# Altium project UmbilicalBoardV3.PrjPcb
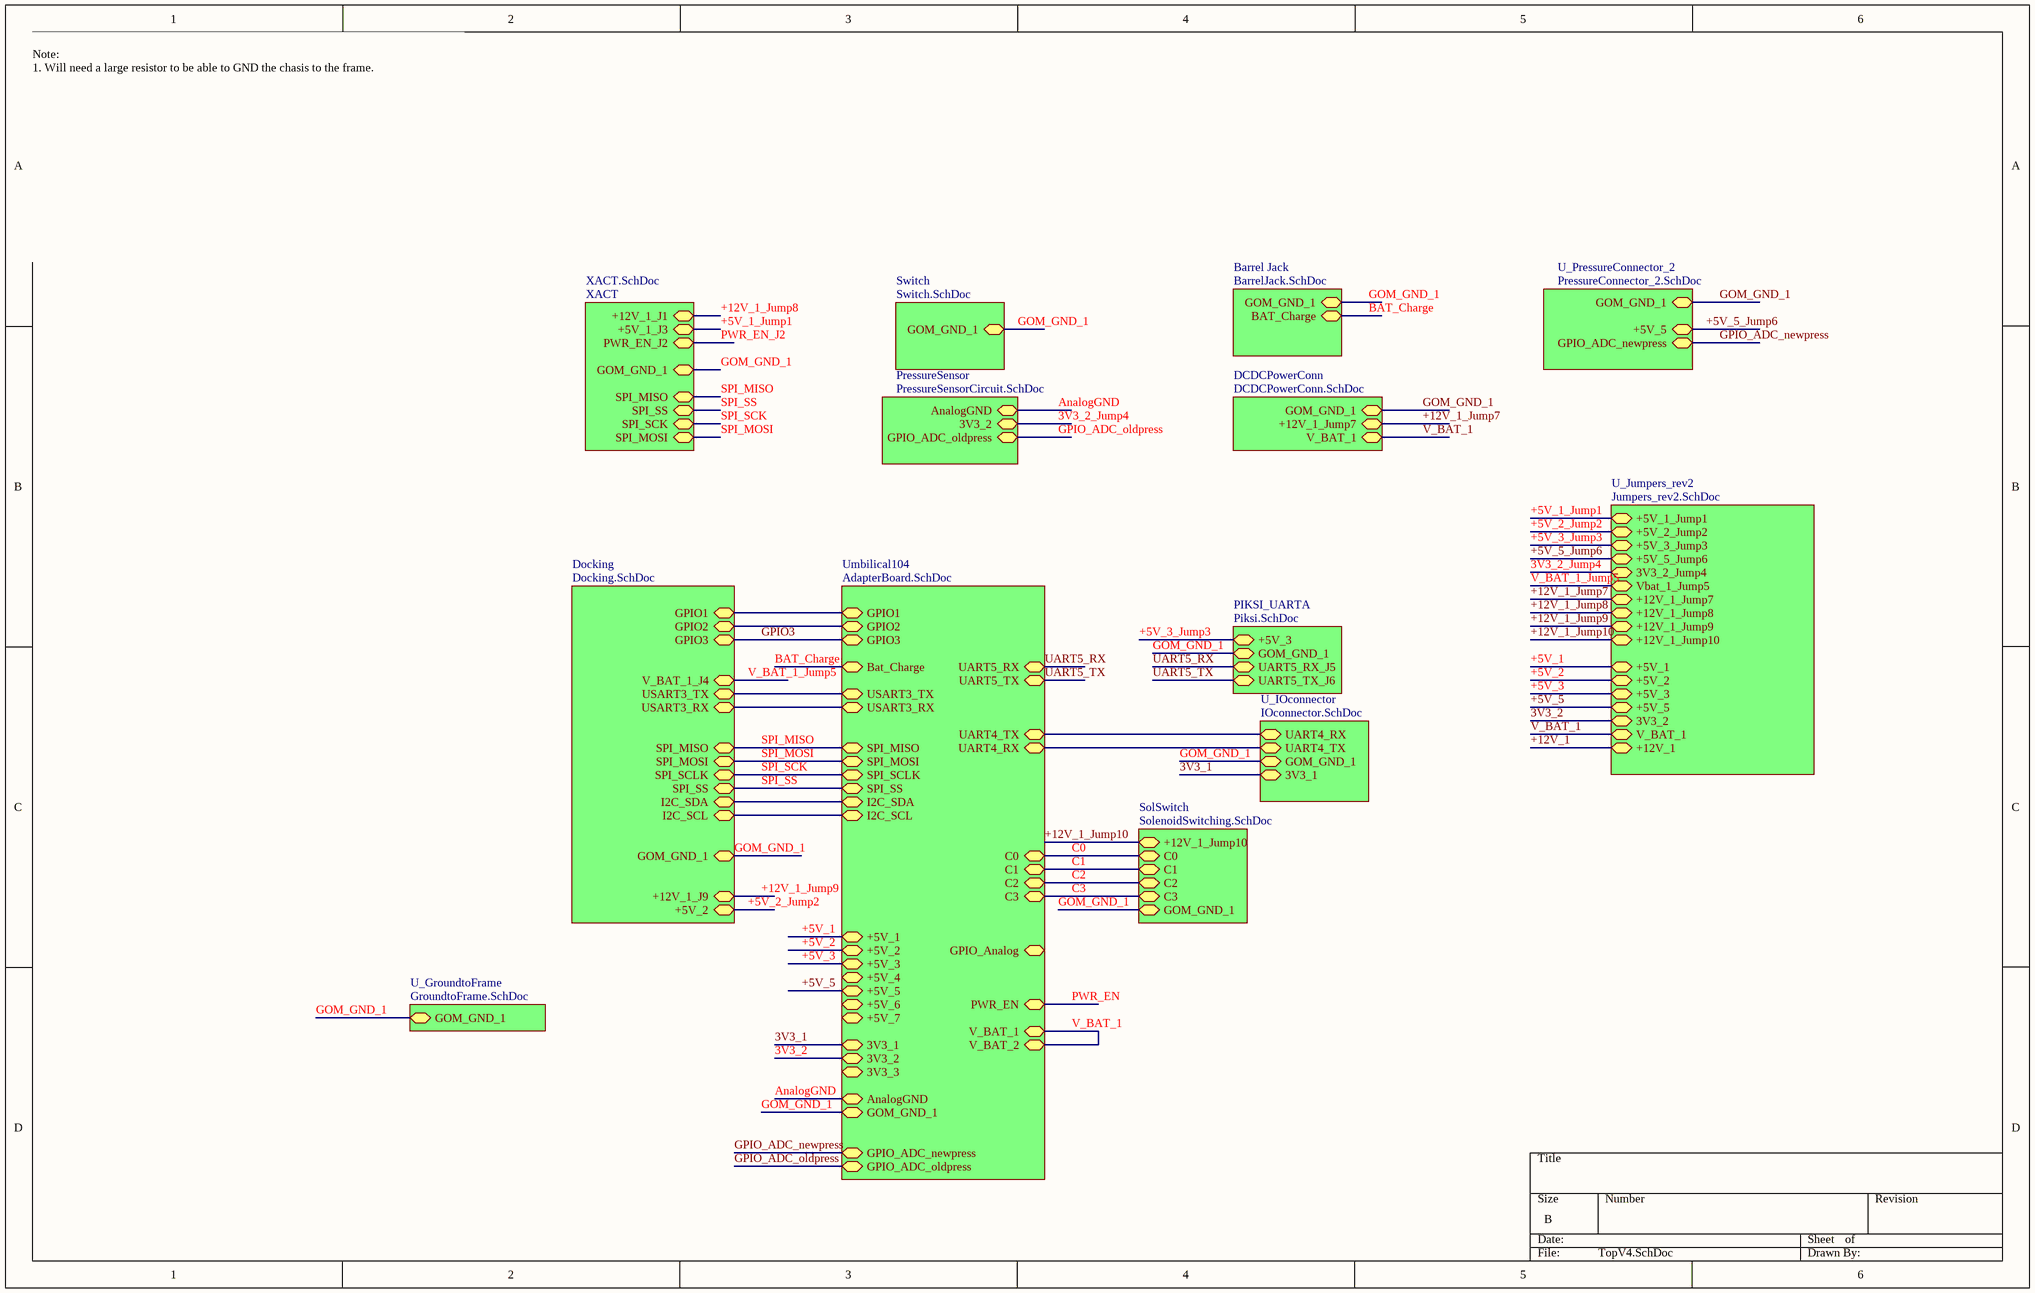
[diagram p0: TopV4.SchDoc]
6 sheets, 30 parts. Net scope: strictly hierarchical (ports join the sheet entries above them; power ports are local).
Board files: UmbilicalBoardV4.PcbDoc, 2016-05-17_12-43-15.PcbDoc
Sheets:
  TopV4.SchDoc
    SolSwitch = SolenoidSwitching.SchDoc
    Umbilical104 = AdapterBoard.SchDoc
    PressureSensor = PressureSensorCircuit.SchDoc
    U_PressureConnector_2 = PressureConnector_2.SchDoc
    DCDCPowerConn = DCDCPowerConn.SchDoc

## Sheet TopV4.SchDoc
size B; Organization: Cornell University; DocumentNumber: 1 of 11; SheetNumber: 1; SheetTotal: 11; DocumentName: Top Sheet; ProjectName: OAAN

### Sub-sheets
Barrel Jack = BarrelJack.SchDoc (file not in this document): GOM_GND_1 (bidir), BAT_Charge (bidir)
DCDCPowerConn = DCDCPowerConn.SchDoc: GOM_GND_1 (bidir), +12V_1_Jump7 (bidir), V_BAT_1 (bidir)
Docking = Docking.SchDoc (file not in this document): V_BAT_1_J4 (bidir), USART3_TX (bidir), SPI_SS (bidir), I2C_SDA (bidir), I2C_SCL (bidir), SPI_MOSI (bidir), SPI_SCLK (bidir), GPIO3 (bidir), +5V_2 (bidir), USART3_RX (bidir), SPI_MISO (bidir), GPIO2 (bidir), +12V_1_J9 (bidir), GPIO1 (bidir), GOM_GND_1 (bidir)
PIKSI_UARTA = Piksi.SchDoc (file not in this document): UART5_RX_J5 (bidir), UART5_TX_J6 (bidir), GOM_GND_1 (bidir), +5V_3 (bidir)
PressureSensor = PressureSensorCircuit.SchDoc: GPIO_ADC_oldpress (bidir), 3V3_2 (bidir), AnalogGND (bidir)
SolSwitch = SolenoidSwitching.SchDoc: C3 (bidir), C2 (bidir), +12V_1_Jump10 (bidir), C1 (bidir), C0 (bidir), GOM_GND_1 (bidir)
Switch = Switch.SchDoc (file not in this document): GOM_GND_1 (bidir)
U_GroundtoFrame = GroundtoFrame.SchDoc (file not in this document): GOM_GND_1 (bidir)
U_IOconnector = IOconnector.SchDoc (file not in this document): UART4_RX (bidir), UART4_TX (bidir), GOM_GND_1 (bidir), 3V3_1 (bidir)
U_Jumpers_rev2 = Jumpers_rev2.SchDoc (file not in this document): +5V_1_Jump1 (bidir), +5V_2_Jump2 (bidir), +5V_3_Jump3 (bidir), 3V3_2_Jump4 (bidir), Vbat_1_Jump5 (bidir), +5V_1 (bidir), +5V_2 (bidir), 3V3_2 (bidir), V_BAT_1 (bidir), +5V_3 (bidir), +5V_5_Jump6 (bidir), +5V_5 (bidir), +12V_1_Jump7 (bidir), +12V_1 (bidir), +12V_1_Jump9 (bidir), +12V_1_Jump8 (bidir), +12V_1_Jump10 (bidir)
U_PressureConnector_2 = PressureConnector_2.SchDoc: GOM_GND_1 (bidir), +5V_5 (bidir), GPIO_ADC_newpress (bidir)
Umbilical104 = AdapterBoard.SchDoc: C0 (bidir), 3V3_1 (bidir), USART3_TX (bidir), USART3_RX (bidir), GPIO3 (bidir), GPIO2 (bidir), GPIO1 (bidir), Bat_Charge (bidir), V_BAT_1 (bidir), I2C_SCL (bidir), SPI_MOSI (bidir), +5V_1 (bidir), I2C_SDA (bidir), SPI_MISO (bidir), SPI_SCLK (bidir), SPI_SS (bidir), UART5_RX (bidir), UART5_TX (bidir), UART4_TX (bidir), UART4_RX (bidir), C3 (bidir), C1 (bidir), C2 (bidir), +5V_3 (bidir), +5V_6 (bidir), +5V_5 (bidir), +5V_2 (bidir), 3V3_2 (bidir), +5V_4 (bidir), 3V3_3 (bidir), +5V_7 (bidir), GOM_GND_1 (bidir), AnalogGND (bidir), PWR_EN (bidir), V_BAT_2 (bidir), GPIO_ADC_newpress (bidir), GPIO_ADC_oldpress (bidir), GPIO_Analog (bidir)
XACT = XACT.SchDoc (file not in this document): +12V_1_J1 (bidir), +5V_1_J3 (bidir), SPI_SCK (bidir), SPI_SS (bidir), GOM_GND_1 (bidir), SPI_MOSI (bidir), SPI_MISO (bidir), PWR_EN_J2 (bidir)

### Nets
3V3_1: sheet Umbilical104/3V3_1, sheet U_IOconnector/3V3_1
3V3_2: sheet Umbilical104/3V3_2, sheet U_Jumpers_rev2/3V3_2
3V3_2_Jump4: sheet PressureSensor/3V3_2, sheet U_Jumpers_rev2/3V3_2_Jump4
+5V_1: sheet Umbilical104/+5V_1, sheet U_Jumpers_rev2/+5V_1
+5V_1_Jump1: sheet XACT/+5V_1_J3, sheet U_Jumpers_rev2/+5V_1_Jump1
+5V_2: sheet Umbilical104/+5V_2, sheet U_Jumpers_rev2/+5V_2
+5V_2_Jump2: sheet Docking/+5V_2, sheet U_Jumpers_rev2/+5V_2_Jump2
+5V_3: sheet Umbilical104/+5V_3, sheet U_Jumpers_rev2/+5V_3
+5V_3_Jump3: sheet PIKSI_UARTA/+5V_3, sheet U_Jumpers_rev2/+5V_3_Jump3
+5V_5: sheet Umbilical104/+5V_5, sheet U_Jumpers_rev2/+5V_5
+5V_5_Jump6: sheet U_Jumpers_rev2/+5V_5_Jump6, sheet U_PressureConnector_2/+5V_5
+12V_1: sheet U_Jumpers_rev2/+12V_1
+12V_1_Jump7: sheet U_Jumpers_rev2/+12V_1_Jump7, sheet DCDCPowerConn/+12V_1_Jump7
+12V_1_Jump8: sheet XACT/+12V_1_J1, sheet U_Jumpers_rev2/+12V_1_Jump8
+12V_1_Jump9: sheet Docking/+12V_1_J9, sheet U_Jumpers_rev2/+12V_1_Jump9
+12V_1_Jump10: sheet SolSwitch/+12V_1_Jump10, sheet U_Jumpers_rev2/+12V_1_Jump10
AnalogGND: sheet Umbilical104/AnalogGND, sheet PressureSensor/AnalogGND
BAT_Charge: sheet Umbilical104/Bat_Charge, sheet Barrel Jack/BAT_Charge
C0: sheet SolSwitch/C0, sheet Umbilical104/C0
C1: sheet SolSwitch/C1, sheet Umbilical104/C1
C2: sheet SolSwitch/C2, sheet Umbilical104/C2
C3: sheet SolSwitch/C3, sheet Umbilical104/C3
GOM_GND_1: sheet SolSwitch/GOM_GND_1, sheet Umbilical104/GOM_GND_1, sheet Switch/GOM_GND_1, sheet Docking/GOM_GND_1, sheet XACT/GOM_GND_1, sheet PIKSI_UARTA/GOM_GND_1, sheet Barrel Jack/GOM_GND_1, sheet U_IOconnector/GOM_GND_1, sheet U_PressureConnector_2/GOM_GND_1, sheet U_GroundtoFrame/GOM_GND_1, sheet DCDCPowerConn/GOM_GND_1
GPIO3: sheet Umbilical104/GPIO3, sheet Docking/GPIO3
GPIO_ADC_newpress: sheet Umbilical104/GPIO_ADC_newpress, sheet U_PressureConnector_2/GPIO_ADC_newpress
GPIO_ADC_oldpress: sheet Umbilical104/GPIO_ADC_oldpress, sheet PressureSensor/GPIO_ADC_oldpress
PWR_EN_J2: sheet XACT/PWR_EN_J2
SPI_MISO: sheet Umbilical104/SPI_MISO, sheet Docking/SPI_MISO, sheet XACT/SPI_MISO
SPI_MOSI: sheet Umbilical104/SPI_MOSI, sheet Docking/SPI_MOSI, sheet XACT/SPI_MOSI
SPI_SCK: sheet Umbilical104/SPI_SCLK, sheet Docking/SPI_SCLK, sheet XACT/SPI_SCK
SPI_SS: sheet Umbilical104/SPI_SS, sheet Docking/SPI_SS, sheet XACT/SPI_SS
UART5_RX: sheet Umbilical104/UART5_RX, sheet PIKSI_UARTA/UART5_RX_J5
UART5_TX: sheet Umbilical104/UART5_TX, sheet PIKSI_UARTA/UART5_TX_J6
V_BAT_1: sheet Umbilical104/V_BAT_1, sheet Umbilical104/V_BAT_2, sheet U_Jumpers_rev2/V_BAT_1, sheet DCDCPowerConn/V_BAT_1
V_BAT_1_Jump5: sheet Docking/V_BAT_1_J4, sheet U_Jumpers_rev2/Vbat_1_Jump5
NetPC-104_H1_13: sheet Umbilical104/UART4_RX, sheet U_IOconnector/UART4_TX
NetPC-104_H1_15: sheet Umbilical104/UART4_TX, sheet U_IOconnector/UART4_RX
NetPC-104_H1_20: sheet Umbilical104/GPIO1, sheet Docking/GPIO1
NetPC-104_H1_24: sheet Umbilical104/GPIO2, sheet Docking/GPIO2
NetPC-104_H1_25: sheet Umbilical104/USART3_TX, sheet Docking/USART3_TX
NetPC-104_H1_27: sheet Umbilical104/USART3_RX, sheet Docking/USART3_RX
NetPC-104_H1_41: sheet Umbilical104/I2C_SDA, sheet Docking/I2C_SDA
NetPC-104_H1_43: sheet Umbilical104/I2C_SCL, sheet Docking/I2C_SCL

### Notes on the sheet
- Note:
  1. Will need a large resistor to be able to GND the chasis to the frame.

## Sheet SolenoidSwitching.SchDoc
size B
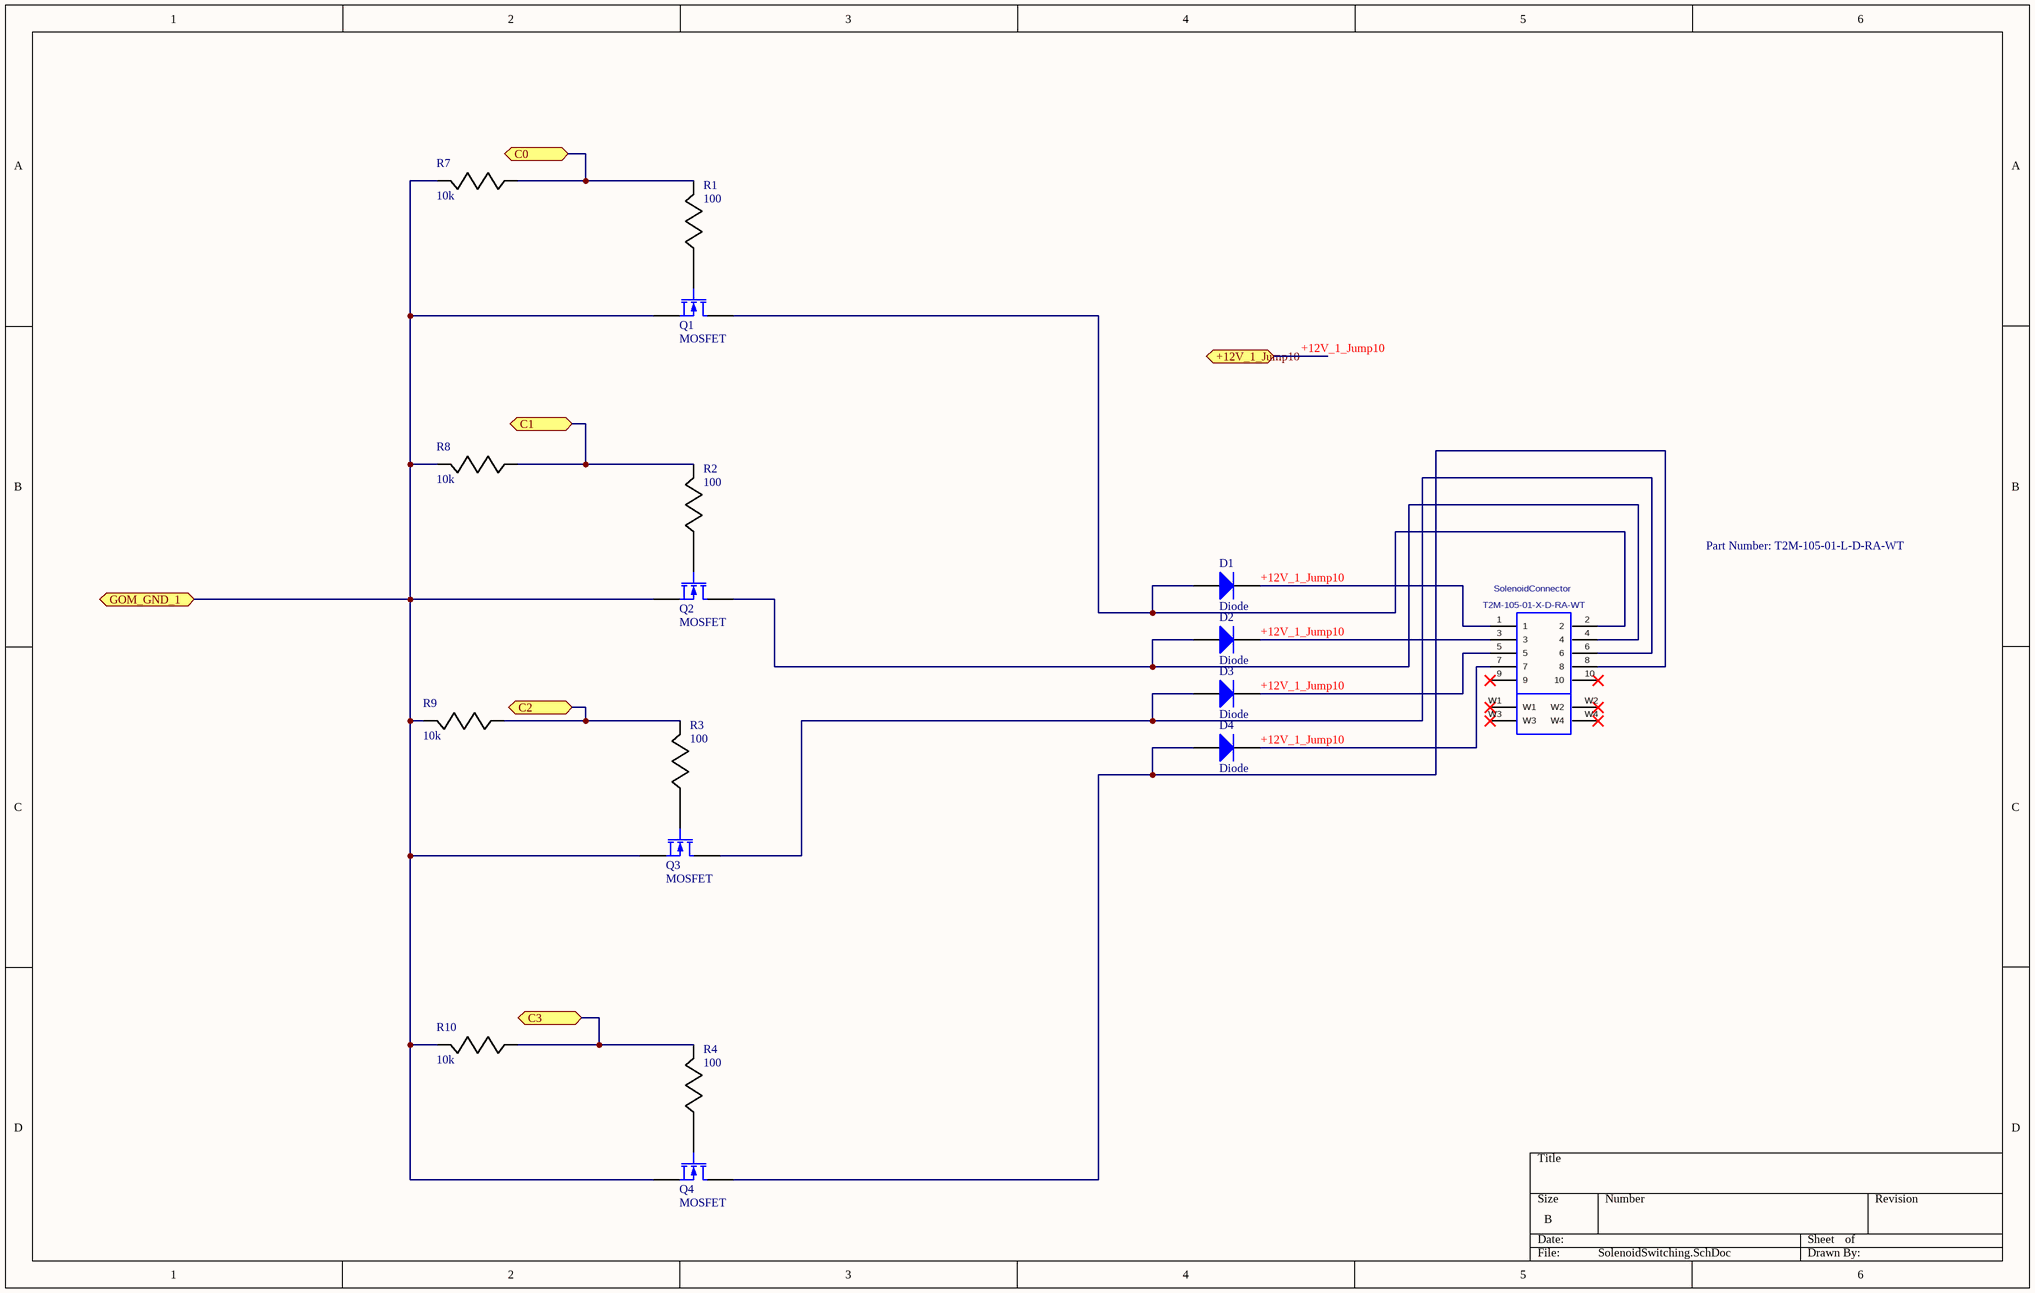
[diagram p1: SolenoidSwitching.SchDoc]

### Parts
D1  Diode  [SMC]
D2  Diode  [SMC]
D3  Diode  [SMC]
D4  Diode  [SMC]
Q1  MOSFET  [TO-226-AA]
Q2  MOSFET  [TO-226-AA]
Q3  MOSFET  [TO-226-AA]
Q4  MOSFET  [TO-226-AA]
R1  100  [AXIAL-0.3]
R2  100  [AXIAL-0.3]
R3  100  [AXIAL-0.3]
R4  100  [AXIAL-0.3]
R7  10k  [AXIAL-0.3]
R8  10k  [AXIAL-0.3]
R9  10k  [AXIAL-0.3]
R10  10k  [AXIAL-0.3]
SolenoidConnector  T2M-105-01-X-D-RA-WT  [T2M-105-01-X-D-RA-WT]

### Ports
+12V_1_Jump10 (bidir), C0 (bidir), C1 (bidir), C2 (bidir), C3 (bidir), GOM_GND_1 (bidir)

### Nets
+12V_1_Jump10: D1.2(K) D2.2(K) D3.2(K) D4.2(K) SolenoidConnector.1 SolenoidConnector.3 SolenoidConnector.5 SolenoidConnector.7 ; port +12V_1_Jump10
C0: R1.1 R7.2 ; port C0
C1: R2.1 R8.2 ; port C1
C2: R3.1 R9.2 ; port C2
C3: R4.1 R10.2 ; port C3
GOM_GND_1: Q1.3(S) Q2.3(S) Q3.3(S) Q4.3(S) R7.1 R8.1 R9.1 R10.1 ; port GOM_GND_1
NetD1_1: D1.1(A) Q1.1(D) SolenoidConnector.2
NetD2_1: D2.1(A) Q2.1(D) SolenoidConnector.4
NetD3_1: D3.1(A) Q3.1(D) SolenoidConnector.6
NetD4_1: D4.1(A) Q4.1(D) SolenoidConnector.8
NetQ1_2: Q1.2(G) R1.2
NetQ2_2: Q2.2(G) R2.2
NetQ3_2: Q3.2(G) R3.2
NetQ4_2: Q4.2(G) R4.2

Not connected (* = marked no-connect by the designer): SolenoidConnector 9* 10* W1* W2* W3* W4*

### Notes on the sheet
- Part Number: T2M-105-01-L-D-RA-WT

### Library data of the parts
D1-D4 = Diode: Default Diode; Published: 8-Jun-2000; LatestRevisionDate: 17-Jul-2002; LatestRevisionNote: Re-released for DXP Platform.; PackageVersion: Sep-1996; PackageReference: SMC; Publisher: Altium Limited; PackageDescription: DO-214-AB/SMC; 2 C-Bend Leads; Body 7.9 x 5.9 mm, inc. leads (LxW); Code_JEDEC: DO-214-AB
Q1-Q4 = MOSFET-N: N-Channel MOSFET; Published: 8-Jun-2000; LatestRevisionDate: 17-Jul-2002; LatestRevisionNote: Re-released for DXP Platform.; PackageVersion: 1995/1996; PackageReference: E3; Publisher: Altium Limited; PackageDescription: TO, Flat Index; 3 In-Line, Axial Leads; Body Dia. 4.6mm; Lead Dia. 0.5 mm (max)
R1-R4 R7-R10 = PMR100HZPFU6L00: Imported; Vendor: Rohm; Value: 6m; Manufacturer_Part_Number: PMR100HZPFU6L00; Manufacturer_Name: Rohm; RefDes: RefDes; TYPE: TYPE
SolenoidConnector = T2M-105-01-X-D-RA-WT: 2MM PITCH SHROUDED RIGHT ANGLE TERMINAL STRIP.; MANUFACTURER: SAMTEC; CREATED: September 24, 2014 - Wendy Xin; PCB DECAL: T2M-105-01-X-D-RA-WT

## Sheet AdapterBoard.SchDoc
size B
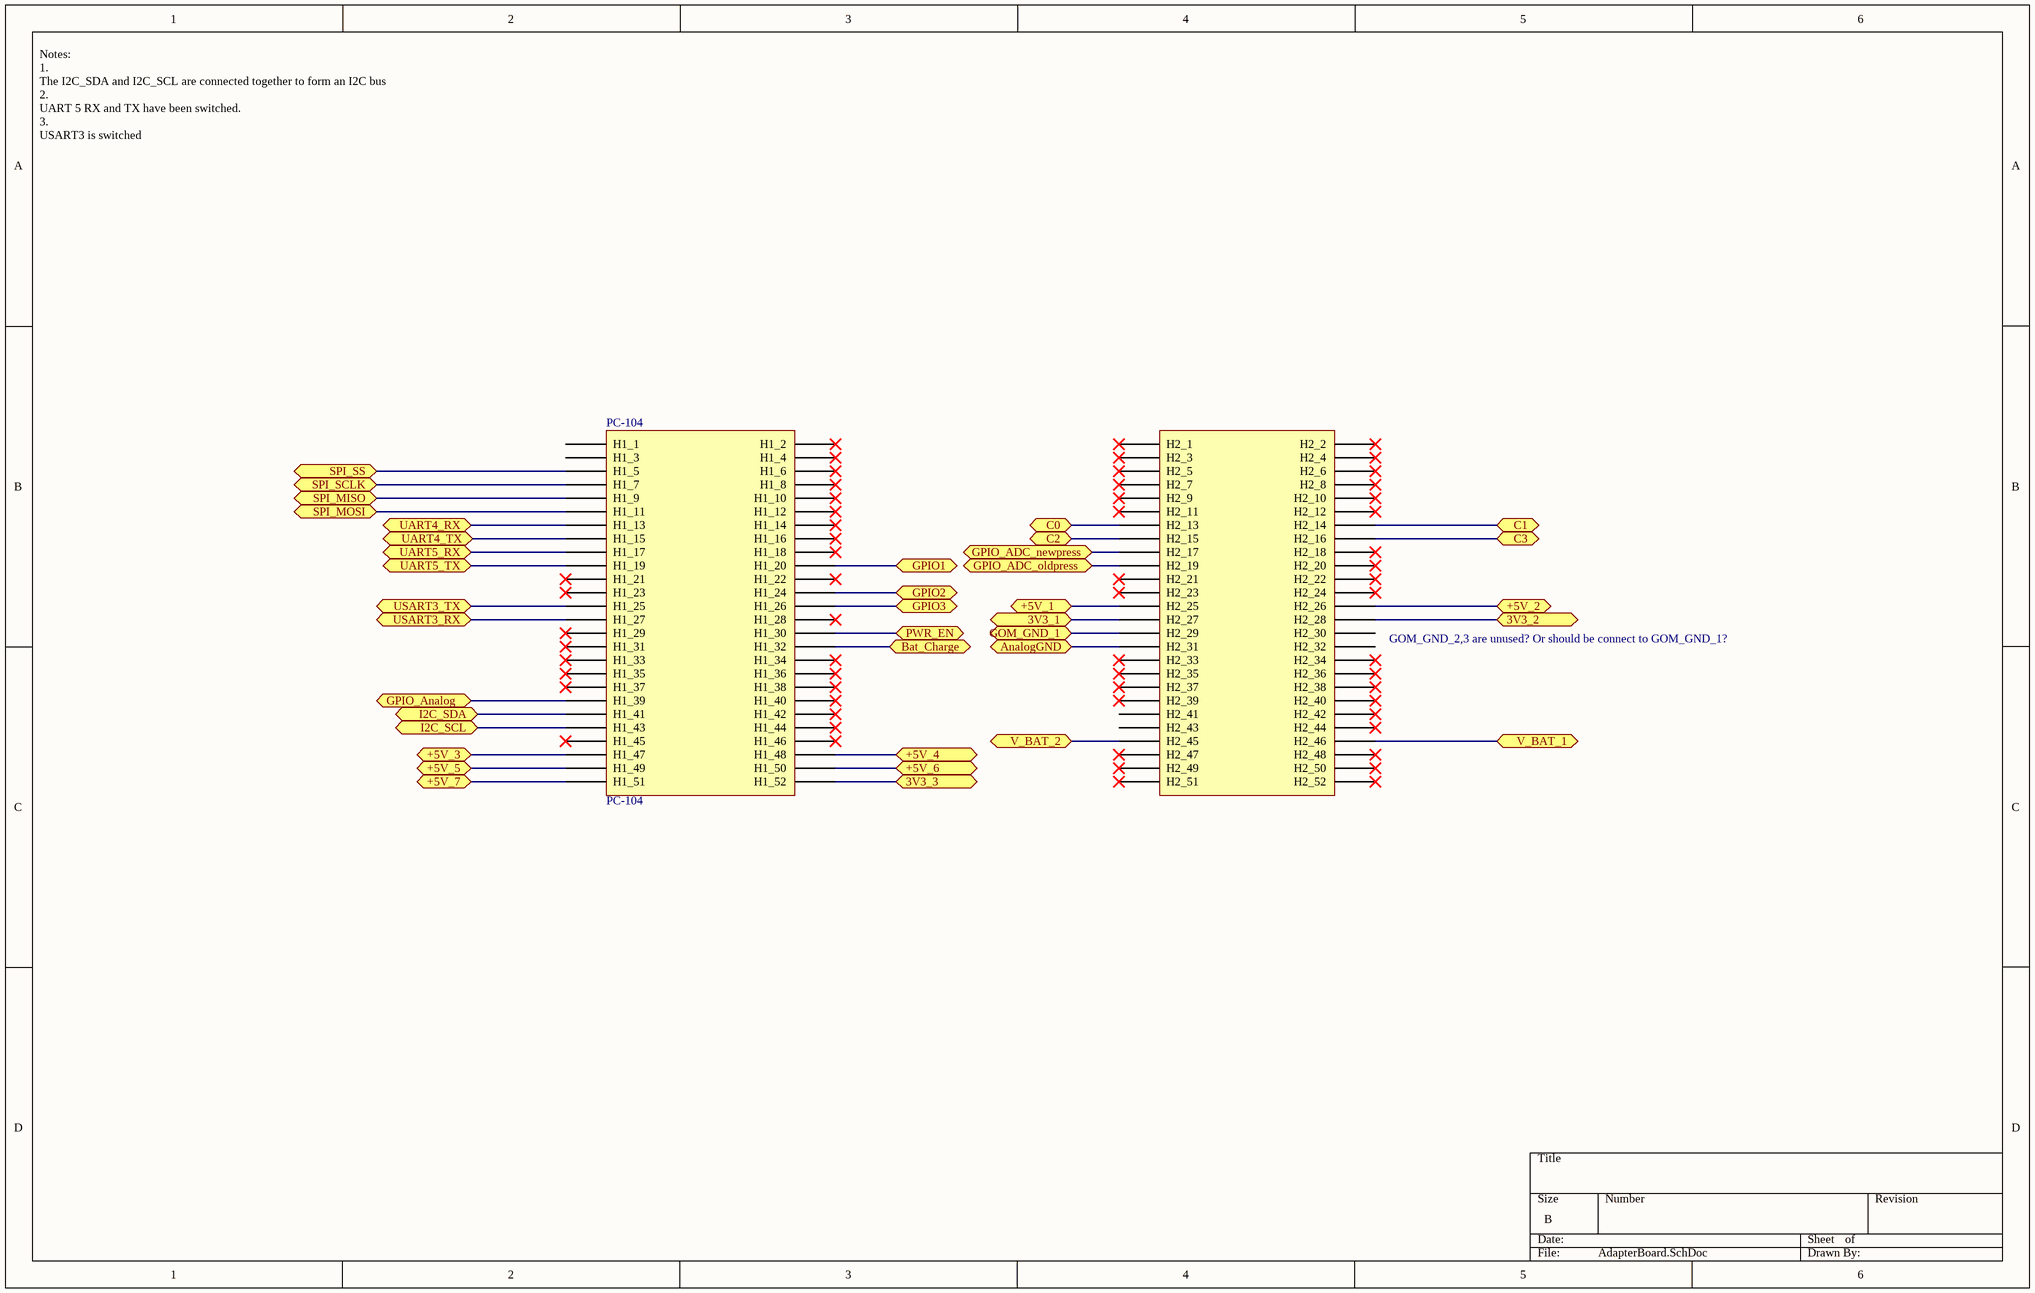
[diagram p2: AdapterBoard.SchDoc]

### Parts
PC-104  PC-104  [PC-104FOOTPRINT]

### Ports
3V3_1 (bidir), 3V3_2 (bidir), 3V3_3 (bidir), +5V_1 (bidir), +5V_2 (bidir), +5V_3 (bidir), +5V_4 (bidir), +5V_5 (bidir), +5V_6 (bidir), +5V_7 (bidir), AnalogGND (bidir), Bat_Charge (bidir), C0 (bidir), C1 (bidir), C2 (bidir), C3 (bidir), GOM_GND_1 (bidir), GPIO1 (bidir), GPIO2 (bidir), GPIO3 (bidir), GPIO_ADC_newpress (bidir), GPIO_ADC_oldpress (bidir), GPIO_Analog (bidir), I2C_SCL (bidir), I2C_SDA (bidir), PWR_EN (bidir), SPI_MISO (bidir), SPI_MOSI (bidir), SPI_SCLK (bidir), SPI_SS (bidir), UART4_RX (bidir), UART4_TX (bidir), UART5_RX (bidir), UART5_TX (bidir), USART3_RX (bidir), USART3_TX (bidir), V_BAT_1 (bidir), V_BAT_2 (bidir)

### Nets
3V3_1: PC-104.H2_27 ; port 3V3_1
3V3_2: PC-104.H2_28 ; port 3V3_2
+5V_1: PC-104.H2_25 ; port +5V_1
+5V_2: PC-104.H2_26 ; port +5V_2
+5V_3: PC-104.H1_47 ; port +5V_3
+5V_5: PC-104.H1_49 ; port +5V_5
AnalogGND: PC-104.H2_31 ; port AnalogGND
BAT_Charge: PC-104.H1_32 ; port Bat_Charge
C0: PC-104.H2_13 ; port C0
C1: PC-104.H2_14 ; port C1
C2: PC-104.H2_15 ; port C2
C3: PC-104.H2_16 ; port C3
GOM_GND_1: PC-104.H2_29 ; port GOM_GND_1
GPIO3: PC-104.H1_26 ; port GPIO3
GPIO_ADC_newpress: PC-104.H2_17 ; port GPIO_ADC_newpress
GPIO_ADC_oldpress: PC-104.H2_19 ; port GPIO_ADC_oldpress
PWR_EN: PC-104.H1_30 ; port PWR_EN
SPI_MISO: PC-104.H1_9 ; port SPI_MISO
SPI_MOSI: PC-104.H1_11 ; port SPI_MOSI
SPI_SCK: PC-104.H1_7 ; port SPI_SCLK
SPI_SS: PC-104.H1_5 ; port SPI_SS
UART5_RX: PC-104.H1_17 ; port UART5_RX
UART5_TX: PC-104.H1_19 ; port UART5_TX
V_BAT_1: PC-104.H2_45 PC-104.H2_46 ; port V_BAT_1, port V_BAT_2
NetPC-104_H1_13: PC-104.H1_13 ; port UART4_RX
NetPC-104_H1_15: PC-104.H1_15 ; port UART4_TX
NetPC-104_H1_20: PC-104.H1_20 ; port GPIO1
NetPC-104_H1_24: PC-104.H1_24 ; port GPIO2
NetPC-104_H1_25: PC-104.H1_25 ; port USART3_TX
NetPC-104_H1_27: PC-104.H1_27 ; port USART3_RX
NetPC-104_H1_39: PC-104.H1_39 ; port GPIO_Analog
NetPC-104_H1_41: PC-104.H1_41 ; port I2C_SDA
NetPC-104_H1_43: PC-104.H1_43 ; port I2C_SCL
NetPC-104_H1_48: PC-104.H1_48 ; port +5V_4
NetPC-104_H1_50: PC-104.H1_50 ; port +5V_6
NetPC-104_H1_51: PC-104.H1_51 ; port +5V_7
NetPC-104_H1_52: PC-104.H1_52 ; port 3V3_3

Not connected (* = marked no-connect by the designer): PC-104 H1_1 H1_2* H1_3 H1_4* H1_6* H1_8* H1_10* H1_12* H1_14* H1_16* H1_18* H1_21* H1_22* H1_23* H1_28* H1_29* H1_31* H1_33* H1_34* H1_35* H1_36* H1_37* H1_38* H1_40* H1_42* H1_44* H1_45* H1_46* H2_1* H2_2* H2_3* H2_4* H2_5* H2_6* H2_7* H2_8* H2_9* H2_10* H2_11* H2_12* H2_18* H2_20* H2_21* H2_22* H2_23* H2_24* H2_30 H2_32 H2_33* H2_34* H2_35* H2_36* H2_37* H2_38* H2_39* H2_40* H2_41 H2_42* H2_43 H2_44* H2_47* H2_48* H2_49* H2_50* H2_51* H2_52*

### Notes on the sheet
- Notes:
  1.
  The I2C_SDA and I2C_SCL are connected together to form an I2C bus
  2.
  UART 5 RX and TX have been switched.
  3.
  USART3 is switched
- GOM_GND_2,3 are unused? Or should be connect to GOM_GND_1?

### Library data of the parts
PC-104 = PC-104: ESQ-126-14-G-D (2 total needed)

## Sheet PressureSensorCircuit.SchDoc
size A
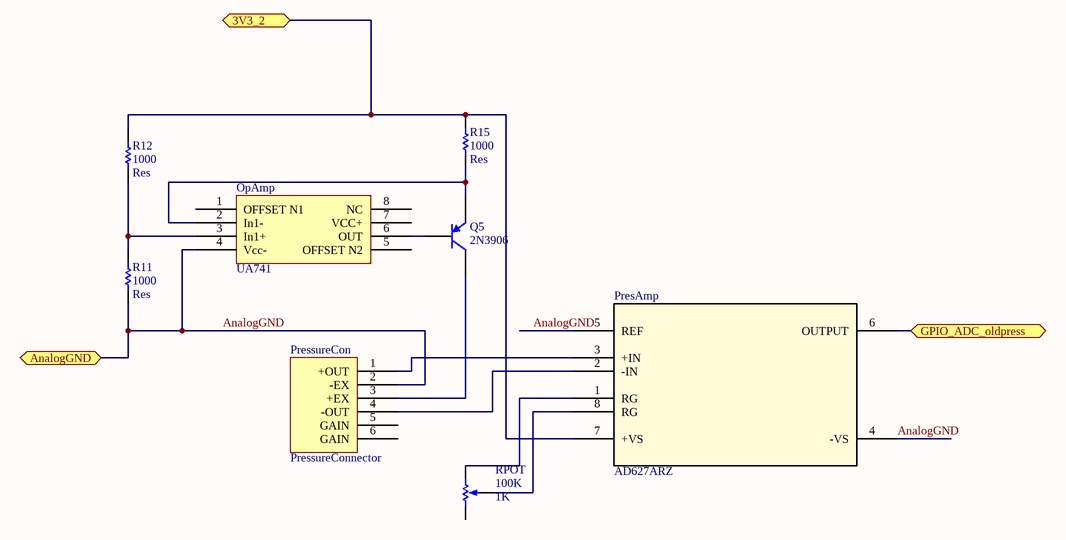
[diagram p3: PressureSensorCircuit.SchDoc]

### Parts
OpAmp  UA741  [UA741]
PresAmp  AD627ARZ  [R_8]
PressureCon  PressureConnector  [Pressure Connector]
Q5  2N3906  [TO-92A]
R11  1000  value Res  [AXIAL-0.3]
R12  1000  value Res  [AXIAL-0.3]
R15  1000  value Res  [AXIAL-0.3]
RPOT  100K  value 1K  [VR5]

### Ports
3V3_2 (bidir), AnalogGND (bidir), GPIO_ADC_oldpress (bidir)

### Nets
3V3_2_Jump4: PresAmp.7(+VS) R12.1 R15.1 ; port 3V3_2
AnalogGND: OpAmp.4(Vcc-) PresAmp.4(-VS) PresAmp.5(REF) PressureCon.2(-EX) R11.2 ; port AnalogGND
GPIO_ADC_oldpress: PresAmp.6(OUTPUT) ; port GPIO_ADC_oldpress
NetOpAmp_2: OpAmp.2(In1-) Q5.1(E) R15.2
NetOpAmp_3: OpAmp.3(In1+) R11.1 R12.2
NetOpAmp_6: OpAmp.6(OUT) Q5.2(B)
NetPresAmp_1: PresAmp.1(RG) RPOT.2(BOT)
NetPresAmp_2: PresAmp.2(-IN) PressureCon.4(-OUT)
NetPresAmp_3: PresAmp.3(+IN) PressureCon.1(+OUT)
NetPresAmp_8: PresAmp.8(RG) RPOT.3(TAP)
NetPressureCon_3: PressureCon.3(+EX) Q5.3(C)

Not connected (* = marked no-connect by the designer): OpAmp 1(OFFSET_N1) 5(OFFSET_N2) 7(VCC+) 8(NC); PressureCon 5(GAIN) 6(GAIN); RPOT 1(TOP)

### Library data of the parts
PresAmp = AD627ARZ: Imported; Manufacturer_Part_Number: AD627ARZ; Vendor: Vendor; RefDes: Refdes; Type: Type; Value: Value
PressureCon = PressureConnector: Molex 53261-0671
Q5 = 2N3906: PNP General Purpose Amplifier; Published: 8-Jun-2000; LatestRevisionDate: 15-Jan-2003; LatestRevisionNote: PCB Footprint 'BCY-W3/D4.7' replaced; DatasheetVersion: 1997; PackageVersion: Sep-1998; PackageReference: TO-92A; Publisher: Altium Limited; PackageDescription: TO, Flat Index; 3 In-Line, Axial Leads; Body Dia. 4.5mm; Leads 0.51 x 0.48 mm (max); ComponentLink1Description: Manufacturer Link; ComponentLink1URL: http://www.fairchildsemi.com/; ComponentLink2Description: Datasheet; ComponentLink2URL: http://www.fairchildsemi.com/ds/2N%2F2N3906.pdf
R11 R12 R15 = Res1: Resistor- 696-1552-ND; Published: 8-Jun-2000; LatestRevisionDate: 17-Jul-2002; LatestRevisionNote: Re-released for DXP Platform.; PackageReference: AXIAL-0.3; Publisher: Altium Limited; PackageDescription: Axial Device, Thru-Hole; 2 Leads; 0.3 in Pin Spacing
RPOT = RPot: Potentiometer; Sim Note: Enter the Resistance value and the set point into parameter fields.; Set Position: 0.5; Published: 8-Jun-2000; LatestRevisionDate: 17-Jul-2002; LatestRevisionNote: Re-released for DXP Platform.; PackageReference: VR5; Publisher: Altium Limited; PackageDescription: Variable Resistor, Thru-Hole; 3 Leads

## Sheet PressureConnector_2.SchDoc
size B
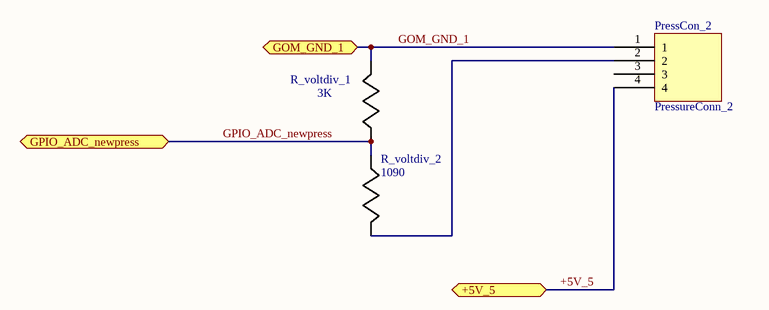
[diagram p4: PressureConnector_2.SchDoc]

### Parts
PressCon_2  PressureConn_2  [PressCon_2]
R_voltdiv_1  3K  [0402]
R_voltdiv_2  1090  [0402]

### Ports
+5V_5 (bidir), GOM_GND_1 (bidir), GPIO_ADC_newpress (bidir)

### Nets
+5V_5: PressCon_2.4 ; port +5V_5  [project net +5V_5_Jump6]
GOM_GND_1: PressCon_2.1 R_voltdiv_1.1 ; port GOM_GND_1
GPIO_ADC_newpress: R_voltdiv_1.2 R_voltdiv_2.2 ; port GPIO_ADC_newpress
NetPressCon_2_2: PressCon_2.2 R_voltdiv_2.1

Not connected (* = marked no-connect by the designer): PressCon_2 3

### Library data of the parts
R_voltdiv_1 = CRCW040210R0FKED: Imported; Vendor: Vishay-Dale; Value: 3000; Manufacturer_Part_Number: CRCW040210R0FKED; Manufacturer_Name: Vishay-Dale; RefDes: RefDes; TYPE: TYPE
R_voltdiv_2 = CRCW040210R0FKED: Imported; Vendor: Vishay-Dale; Manufacturer_Part_Number: CRCW040210R0FKED; Manufacturer_Name: Vishay-Dale; RefDes: RefDes; TYPE: TYPE; Value: 1090

## Sheet DCDCPowerConn.SchDoc
size A
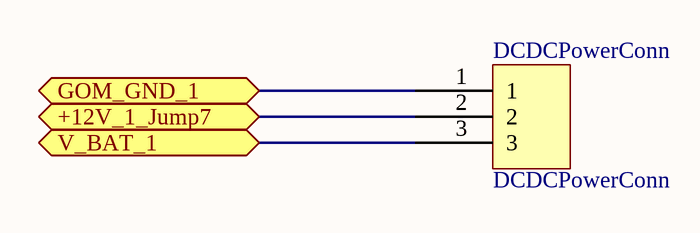
[diagram p5: DCDCPowerConn.SchDoc]

### Parts
DCDCPowerConn  DCDCPowerConn

### Ports
+12V_1_Jump7 (bidir), GOM_GND_1 (bidir), V_BAT_1 (bidir)

### Nets
+12V_1_Jump7: DCDCPowerConn.2 ; port +12V_1_Jump7
GOM_GND_1: DCDCPowerConn.1 ; port GOM_GND_1
V_BAT_1: DCDCPowerConn.3 ; port V_BAT_1

## Nets that join several sheets
AnalogGND: AdapterBoard (PC-104.H2_31), PressureSensorCircuit (5 pins)
C0: SolenoidSwitching (R1.1 R7.2), AdapterBoard (PC-104.H2_13)
C1: SolenoidSwitching (R2.1 R8.2), AdapterBoard (PC-104.H2_14)
C2: SolenoidSwitching (R3.1 R9.2), AdapterBoard (PC-104.H2_15)
C3: SolenoidSwitching (R4.1 R10.2), AdapterBoard (PC-104.H2_16)
GOM_GND_1: SolenoidSwitching (8 pins), AdapterBoard (PC-104.H2_29), PressureConnector_2 (PressCon_2.1 R_voltdiv_1.1), DCDCPowerConn (DCDCPowerConn.1)
GPIO_ADC_newpress: AdapterBoard (PC-104.H2_17), PressureConnector_2 (R_voltdiv_1.2 R_voltdiv_2.2)
GPIO_ADC_oldpress: AdapterBoard (PC-104.H2_19), PressureSensorCircuit (PresAmp.6)
V_BAT_1: AdapterBoard (PC-104.H2_45 PC-104.H2_46), DCDCPowerConn (DCDCPowerConn.3)